# Altium schematic sheet 01docmap.SchDoc
size B
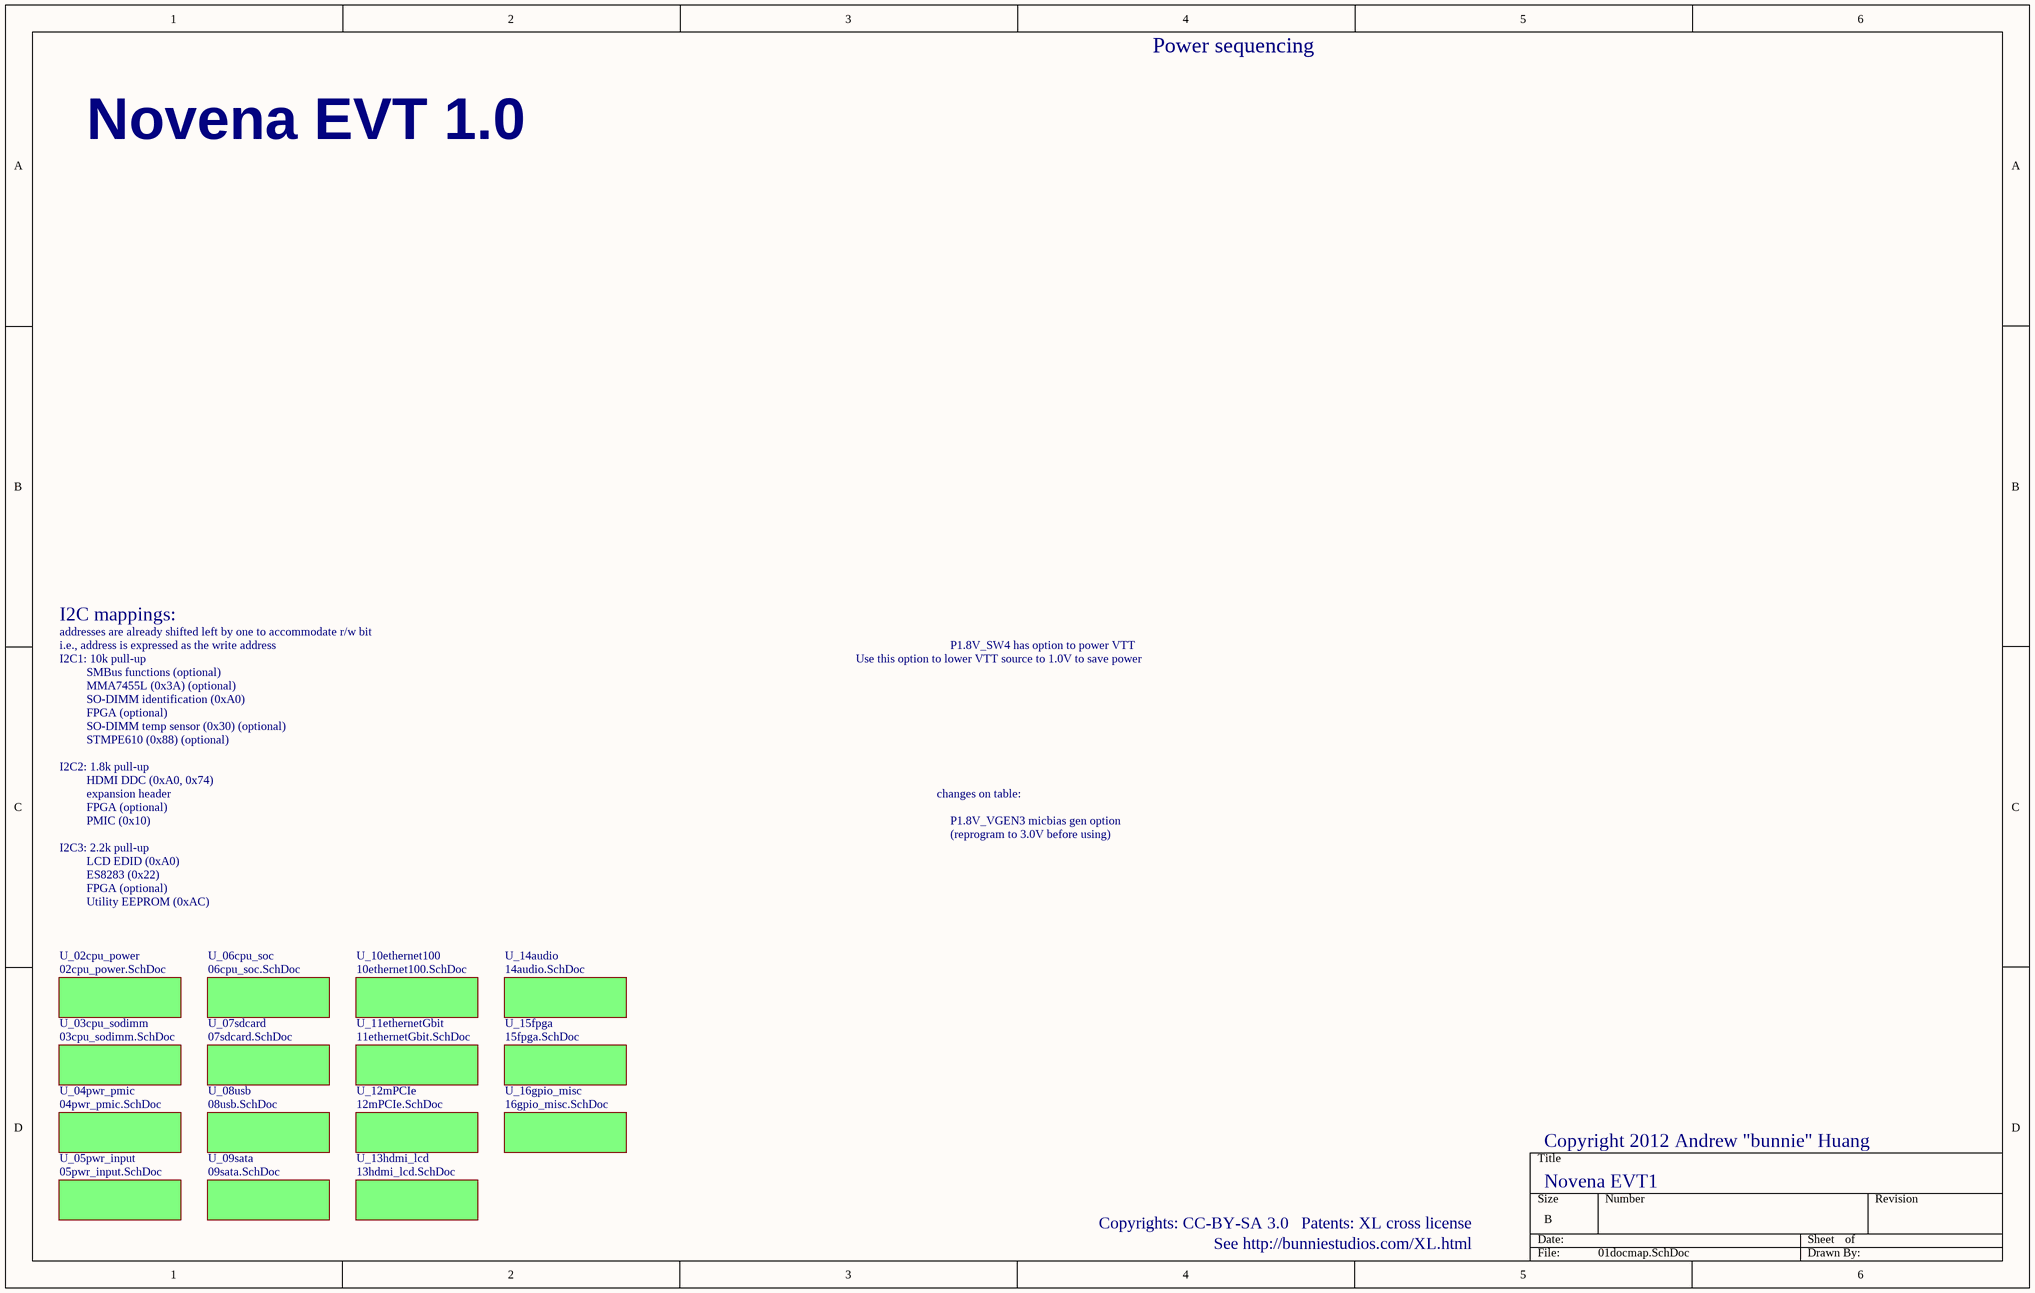
[diagram p0: 01docmap.SchDoc]

## Sub-sheets
U_02cpu_power = 02cpu_power.SchDoc: no entries
U_03cpu_sodimm = 03cpu_sodimm.SchDoc: no entries
U_04pwr_pmic = 04pwr_pmic.SchDoc: no entries
U_05pwr_input = 05pwr_input.SchDoc: no entries
U_06cpu_soc = 06cpu_soc.SchDoc: no entries
U_07sdcard = 07sdcard.SchDoc: no entries
U_08usb = 08usb.SchDoc: no entries
U_09sata = 09sata.SchDoc: no entries
U_10ethernet100 = 10ethernet100.SchDoc: no entries
U_11ethernetGbit = 11ethernetGbit.SchDoc: no entries
U_12mPCIe = 12mPCIe.SchDoc: no entries
U_13hdmi_lcd = 13hdmi_lcd.SchDoc: no entries
U_14audio = 14audio.SchDoc: no entries
U_15fpga = 15fpga.SchDoc: no entries
U_16gpio_misc = 16gpio_misc.SchDoc: no entries

## Notes on the sheet
- Power sequencing
- Novena EVT 1.0
- I2C mappings:
- addresses are already shifted left by one to accommodate r/w bit
- I2C1: 10k pull-up
- i.e., address is expressed as the write address
- SMBus functions (optional)
- MMA7455L (0x3A) (optional)
- SO-DIMM identification (0xA0)
- Use this option to lower VTT source to 1.0V to save power
- P1.8V_SW4 has option to power VTT
- I2C2: 1.8k pull-up
- FPGA (optional)
- SO-DIMM temp sensor (0x30) (optional)
- STMPE610 (0x88) (optional)
- HDMI DDC (0xA0, 0x74)
- expansion header
- PMIC (0x10)
- changes on table:
- P1.8V_VGEN3 micbias gen option
- (reprogram to 3.0V before using)
- I2C3: 2.2k pull-up
- LCD EDID (0xA0)
- ES8283 (0x22)
- Utility EEPROM (0xAC)
- Copyright 2012 Andrew "bunnie" Huang
- Copyrights: CC-BY-SA 3.0
- Patents: XL cross license
- Novena EVT1
- See http://bunniestudios.com/XL.html